# EasyEDA Pro project U2HTS_F070F6.eprj

# Schematic Schematic1
Board Name: Board1; Create Date: 2025-01-21; Page Name: P1; Project Name: U2HTS-STM32F070C6; Schematic Name: Schematic1; Update Date: 2025-03-15; Company: 嘉立创EDA; Page Size: A4; Version: V1.0
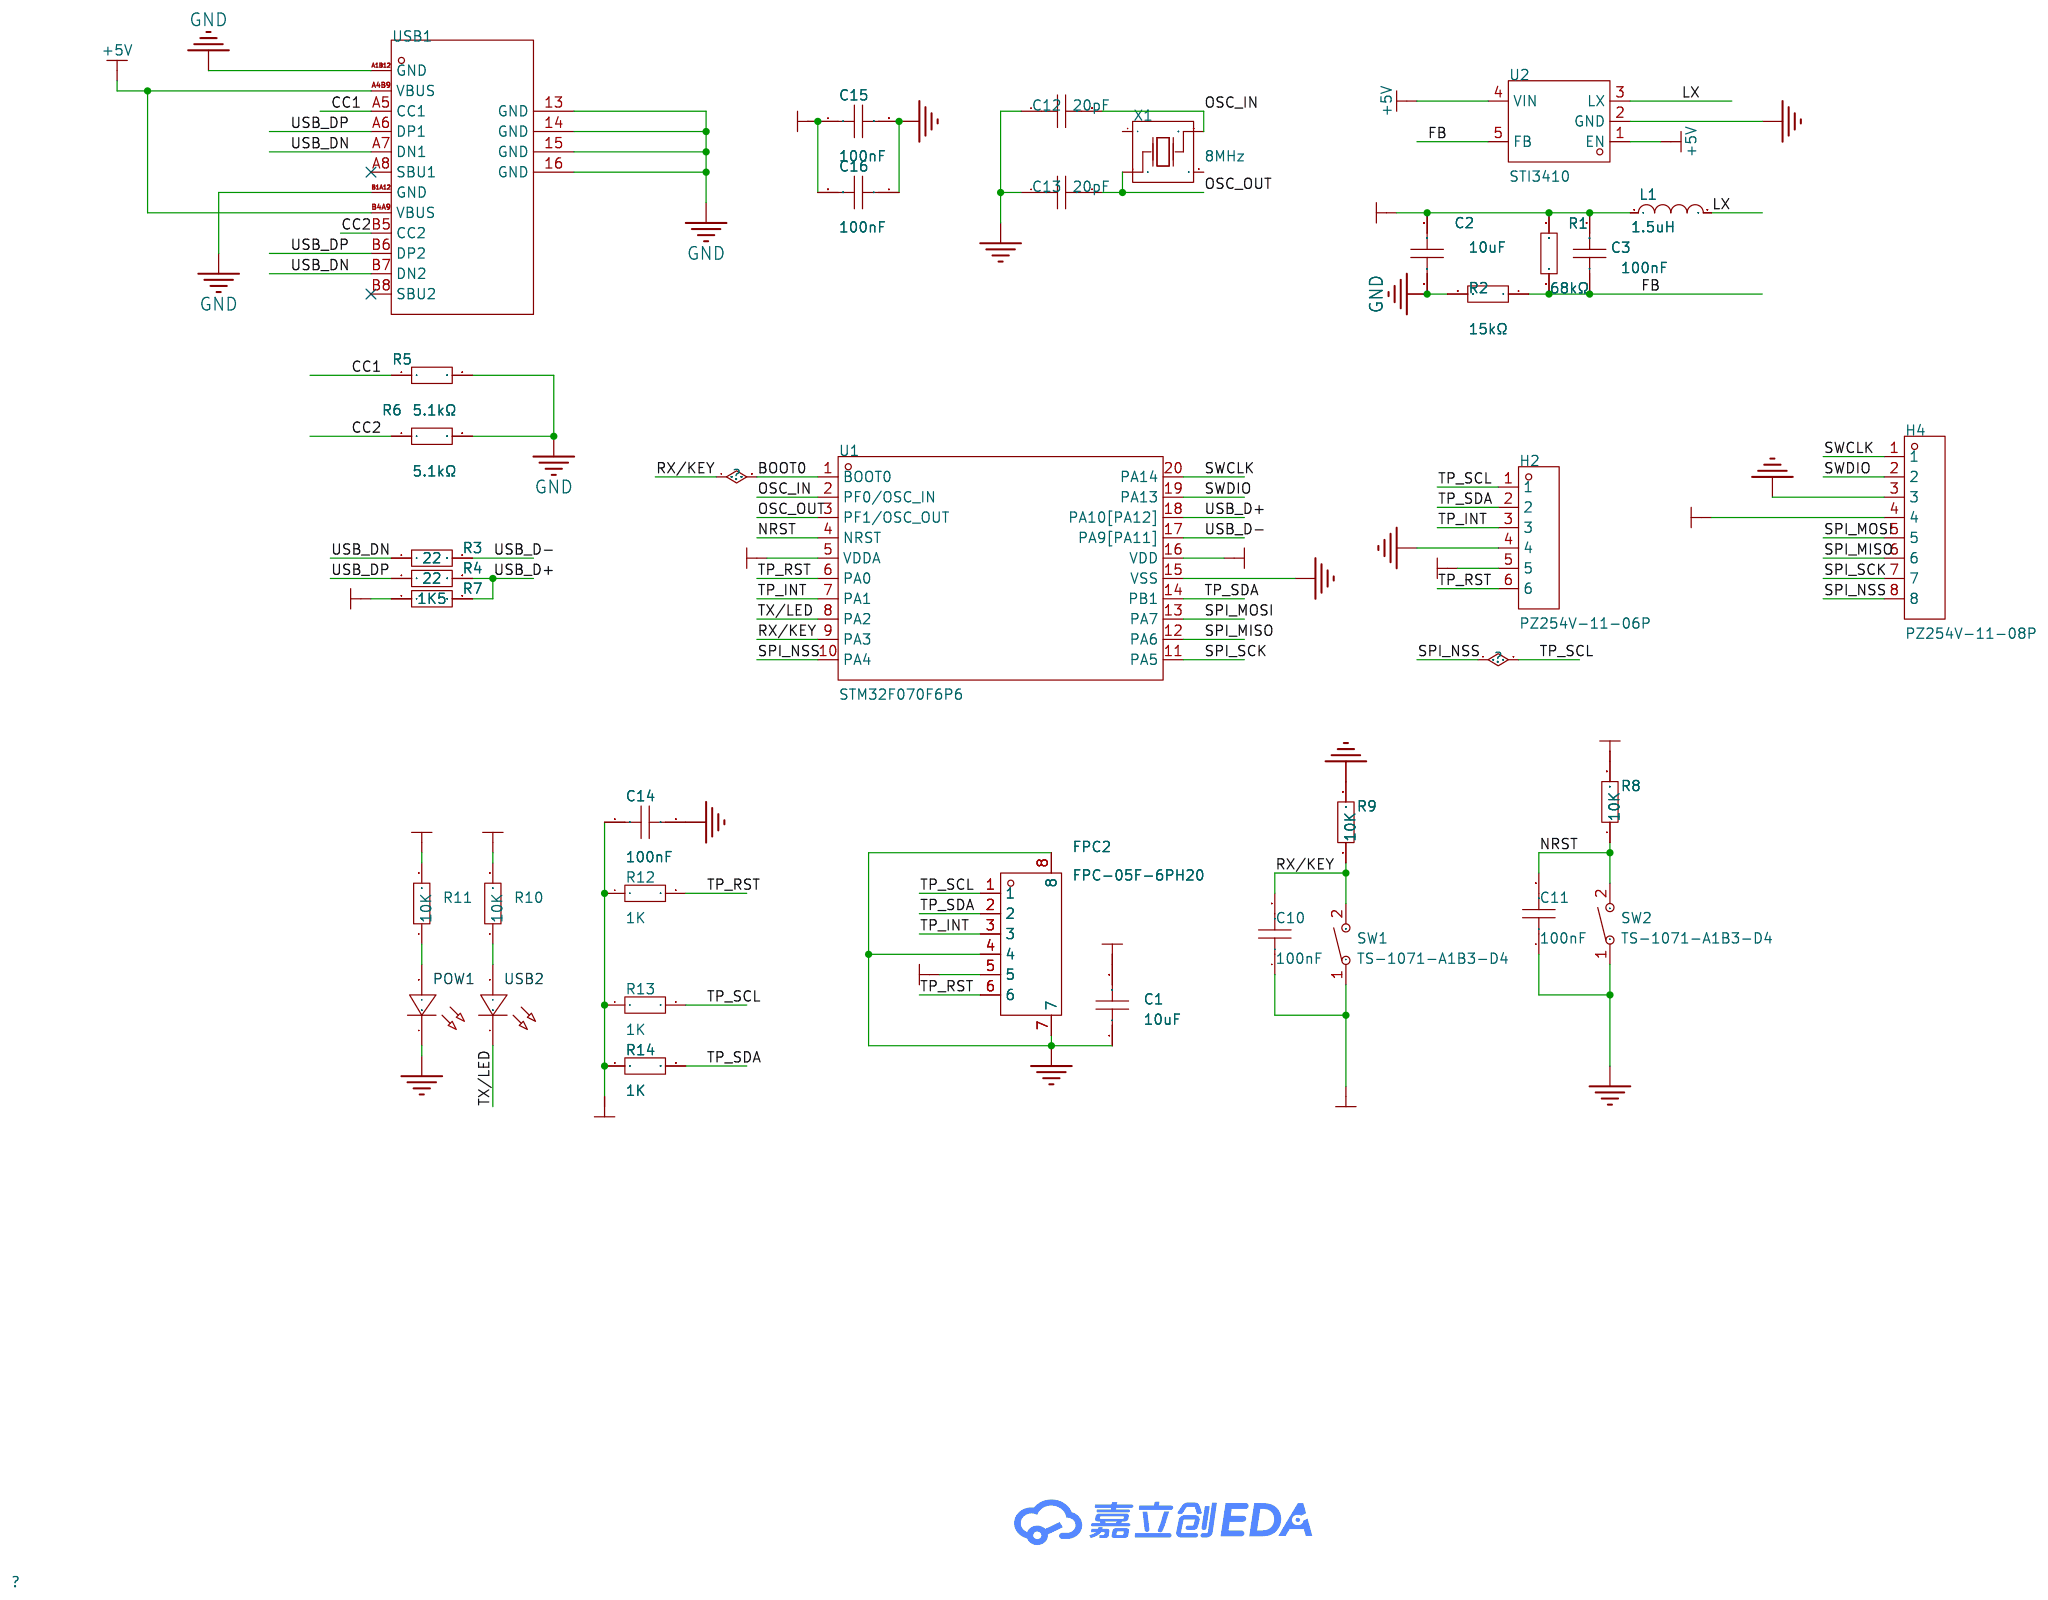
[diagram p0: schematic sheet]

## Parts
C1  10uF  [C0603]
C2  10uF  [C0603]
C3  100nF  [C0402]
C10  100nF  [C0402]
C11  100nF  [C0402]
C12  20pF  [C0402]
C13  20pF  [C0402]
C14  100nF  [C0402]
C15  100nF  [C0402]
C16  100nF  [C0402]
FPC2  FPC-05F-6PH20  [FPC-SMD_6P-P0.50_XUNPU_FPC-05F-6PH20]
H2  PZ254V-11-06P  [HDR-TH_6P-P2.54-V-M]
H4  PZ254V-11-08P  [HDR-TH_8P-P2.54-V-M]
L1  1.5uH  [L1008]
POW1  -  [LED_0603]
R1  68kΩ  [R0402]
R2  15kΩ  [R0402]
R3  22  [R0402]
R4  22  [R0402]
R5  5.1kΩ  [R0402]
R6  5.1kΩ  [R0402]
R7  1K5  [R0402]
R8  10K  [R0402]
R9  10K  [R0402]
R10  10K  [R0402]
R11  10K  [R0402]
R12  1K  [R0402]
R13  1K  [R0402]
R14  1K  [R0402]
SW1  TS-1071-A1B3-D4  [KEY-SMD_L4.0-W2.9-LS4.8]
SW2  TS-1071-A1B3-D4  [KEY-SMD_L4.0-W2.9-LS4.8]
U1  STM32F070F6P6  [TSSOP-20_L6.5-W4.4-P0.65-LS6.4-BL]
U2  STI3410  [SOT-23-5_L3.0-W1.7-P0.95-LS2.8-BL]
USB1  -  [USB-C-SMD_TYPEC-304-BCP16]
USB2  -  [LED_0603]
X1  8MHz  [CRYSTAL-SMD_4P-L3.2-W2.5-BL]

## Library data of the parts
C1 = CGA0603X5R106K100JT: 容值:10uF;精度:±10%;额定电压:10V;材质(温度系数):X5R;; LCSC Part Name: 10uF ±10% 10V; Supplier Part: C6119842; Manufacturer: HRE(芯声); Supplier Footprint: 0603; JLCPCB Part Class: Extended Part; Supplier: LCSC; Tolerance: ±10%; Voltage Rated: 10V; Temperature Coefficient: X5R
C2 = HGC0603R5106M160NTHJ: 容值:10uF;精度:±20%;额定电压:16V;材质(温度系数):X5R;; LCSC Part Name: 10uF ±20% 16V; Supplier Part: C7472959; Manufacturer: Chinocera(华瓷); Supplier Footprint: 0603; JLCPCB Part Class: Extended Part; Datasheet: https://atta.szlcsc.com/upload/public/pdf/source/20240320/FAC3FEC40A78BC5CCCE96C232A94D860.pdf; Supplier: LCSC; Tolerance: ±20%; Voltage Rated: 16V; Temperature Coefficient: X5R
C3 = GRM155R71H104KE14D: 容值:100nF;精度:±10%;额定电压:50V;材质(温度系数):X7R;; LCSC Part Name: 100nF ±10% 50V; Supplier Part: C77020; Manufacturer: muRata(村田); Supplier Footprint: 0402; JLCPCB Part Class: Extended Part; Datasheet: https://atta.szlcsc.com/upload/public/pdf/source/20180326/C77020_39BD49C951FF1AF0DB1F1FAC5AC1E401.pdf; Supplier: LCSC; Tolerance: ±10%; Voltage Rated: 50V; Temperature Coefficient: X7R
C10-C13 = CAP_0603: Supplier Footprint: 0603
C14-C16 = CAP_0402: Supplier Footprint: 0402
FPC2 = FPC-05F-6PH20: 锁定特性:翻盖式;触点类型:下接;触点数量:6P;间距:0.5mm;安装类型:卧贴;工作温度范围:-25℃~+85℃;; LCSC Part Name: 间距:0.5mm P数:6P 翻盖式 下接; Supplier Part: C2856796; Manufacturer: XUNPU(讯普); Supplier Footprint: SMD,P=0.5mm,卧贴; JLCPCB Part Class: 扩展库; Datasheet: https://atta.szlcsc.com/upload/public/pdf/source/20210922/16B003FB53336DDF6538142CC465AC4D.pdf; Supplier: LCSC; Locking Feature: 翻盖式; Contact Type: 下接; Number of Contacts: 6P; Pitch: 0.5mm; Mounting Type: 卧贴; FFC, FCB Thickness: 0.3mm; Height Above Board: 2mm; Operating Temperature Range: -25℃~+85℃
H2 = PZ254V-11-06P: LCSC Part Name: 间距:2.54mm 1x6P 直插 方针; Supplier Part: C492405; Manufacturer: XFCN(兴飞); Supplier Footprint: 插件,P=2.54mm; JLCPCB Part Class: 扩展库; Datasheet: https://atta.szlcsc.com/upload/public/pdf/source/20200309/C492405_597F1930F5B55CC3C7FD95458F1C3977.pdf; Supplier: LCSC; Pin Structure: 1x6P; Pitch: 2.54mm; Circluar Pins/Square Pins: 方针; Mounting Type: 直插; Number of Rows: 单排; Number of Pins: 6P; Length of Mating Pin: 6mm; Insulation Height: 2.5mm; Length of End Connection Pin: 3mm; Contact Material: 黄铜; Operating Temperature Range: -40℃~+105℃; Color: 黑色
H4 = PZ254V-11-08P: LCSC Part Name: 间距:2.54mm 1x8P 直插 方针; Supplier Part: C492407; Manufacturer: XFCN(兴飞); Supplier Footprint: 插件,P=2.54mm; JLCPCB Part Class: 扩展库; Datasheet: https://atta.szlcsc.com/upload/public/pdf/source/20200309/C492407_83A6FB26A2233368EDB9516968EC6149.pdf; Supplier: LCSC; Pin Structure: 1x8P; Pitch: 2.54mm; Circluar Pins/Square Pins: 方针; Mounting Type: 直插; Number of Rows: 单排; Number of Pins: 8P; Length of Mating Pin: 6mm; Insulation Height: 2.5mm; Length of End Connection Pin: 3mm; Contact Material: 黄铜; Operating Temperature Range: -40℃~+105℃; Color: 黑色
L1 = FHD252010S-1R5MT: 电感值:1.5uH;精度:±20%;额定电流:2.3A;饱和电流(Isat):3A;; LCSC Part Name: 1.5uH ±20% 3A; Supplier Part: C602003; Manufacturer: cjiang(长江微电); Supplier Footprint: 1008; JLCPCB Part Class: Extended Part; Datasheet: https://atta.szlcsc.com/upload/public/pdf/source/20200609/C601990_BCEA243EC4DA0A9A288AA78A6DFB48A5.pdf; Supplier: LCSC; Tolerance: ±20%; Rated Current: 2.3A; Saturation Current (Isat): 3A; DC Resistance (DCR): 90mΩ
POW1 = LED_0603-G: Supplier Footprint: 0603
R1 = 0402WGF6802TCE: 电阻类型:厚膜电阻;阻值:68kΩ;精度:±1%;功率:62.5mW;最大工作电压:50V;温度系数:±100ppm/℃;; LCSC Part Name: 68kΩ ±1% 62.5mW 厚膜电阻; Supplier Part: C36871; Manufacturer: UNI-ROYAL(厚声); Supplier Footprint: 0402; JLCPCB Part Class: Extended Part; Datasheet: https://atta.szlcsc.com/upload/public/pdf/source/20200306/C422600_1E6D84923E4A46A82E41ADD87F860B5C.pdf; Supplier: LCSC; Type: 厚膜电阻; Tolerance: ±1%; Power(Watts): 62.5mW; Overload Voltage (Max): 50V; Temperature Coefficient: ±100ppm/℃; Operating Temperature Range: -55℃~+155℃
R2 = 0402WGF1502TCE: 电阻类型:厚膜电阻;阻值:15kΩ;精度:±1%;功率:62.5mW;最大工作电压:50V;温度系数:±100ppm/℃;; LCSC Part Name: 15kΩ ±1% 62.5mW 厚膜电阻; Supplier Part: C25756; Manufacturer: UNI-ROYAL(厚声); Supplier Footprint: 0402; JLCPCB Part Class: Basic Part; Datasheet: https://atta.szlcsc.com/upload/public/pdf/source/20200306/C422600_1E6D84923E4A46A82E41ADD87F860B5C.pdf; Supplier: LCSC; Type: 厚膜电阻; Tolerance: ±1%; Power(Watts): 62.5mW; Overload Voltage (Max): 50V; Temperature Coefficient: ±100ppm/℃; Operating Temperature Range: -55℃~+155℃
R3 R4 R7-R11 = Res_0603: Supplier Footprint: 0603
R5 R6 = RMC04025.1K1%N: 阻值:5.1kΩ;精度:±1%;功率:62.5mW;; LCSC Part Name: 5.1kΩ ±1% 62.5mW; Supplier Part: C325521; Manufacturer: Tyohm(幸亚电阻); Supplier Footprint: 0402; JLCPCB Part Class: Extended Part; Datasheet: https://atta.szlcsc.com/upload/public/pdf/source/20190115/C325521_1EC5F156994D781C7E2B08432302F19F.pdf; Supplier: LCSC; Tolerance: ±1%; Power(Watts): 62.5mW
R12-R14 = Res_0402: Supplier Footprint: 0402
SW1 SW2 = TS-1071-A1B3-D4: 电路结构:单刀单掷;安装方式:-;按钮形状:圆形按钮;带灯:-;作用力:250gf@±30gf;开关长度:4mm;开关宽度:3mm;开关高度:2mm;; LCSC Part Name: 轻触开关4.0*3.0*2两脚贴片带柱小龟250gf; Supplier Part: C492877; Manufacturer: Yuandi(元迪); JLCPCB Part Class: 扩展库; Datasheet: https://atta.szlcsc.com/upload/public/pdf/source/20200316/C492878_F665FC46291D1CEBBF5F4DDB4422506A.pdf; Supplier: LCSC; Circuit: 单刀单掷; Actuator Style: 圆形按钮; Operating Force: 250gf@±30gf; Switch Length: 4mm; Switch Width: 3mm; Switch Height: 2mm
U1 = STM32F070F6P6: LCSC Part Name: 主流ARM Cortex-M0超值系列MCU，具有至多32 KB Flash、48 MHz CPU和USB功能; Supplier Part: C86951; Manufacturer: ST(意法半导体); Supplier Footprint: TSSOP-20; JLCPCB Part Class: 扩展库; Datasheet: https://atta.szlcsc.com/upload/public/pdf/source/20170105/1483608757662.pdf; Supplier: LCSC; CPU Core: ARM-M0; CPU Maximum Speed: 48MHz; Program Storage Size: 32KB; Program Memory Type: FLASH; Number of I/O: 15; ADC (Bit): 12bit; Low Voltage Detection Threshold: 2.4V~3.6V
U2 = STI3410: 功能类型:降压型;输出类型:可调;工作电压:2.3V~6V;输出电压:600mV~6V;输出电流:1.5A;; LCSC Part Name: 1.0MHz 1.5A 同步降压转换器; Supplier Part: C711928; Manufacturer: TMI(拓尔微); Supplier Footprint: SOT-23-5; JLCPCB Part Class: 扩展库; Datasheet: https://atta.szlcsc.com/upload/public/pdf/source/20240703/A4E038F154E42B2F4CBA4BC59A7F6257.pdf; Supplier: LCSC; Function: 降压型; Output Type: 可调; Input Voltage: 2.3V~6V; Output Voltage: 600mV~6V; Output Current: 1.5A; Switching Frequency: 1MHz; Operating Temperature: -40℃~+85℃; Synchronous Rectification: 是; Number of Outputs: 1; Topology: 降压式; Quiescent Current (Iq): 40uA; Switch tube (built-in/external): 内置
USB1 = typec-304-bcp16: 连接器类型:Type-C;标准:USB 3.1;公母:母座;触点数量:16.0;端口数量:1;安装方式:卧贴;额定电流 - 电源:3A;工作温度范围:-25~+85;焊接温度(最大值):260;; LCSC Part Name: TYPEC-304-BCP16; Supplier Part: C720629; Manufacturer: XUNPU(讯普); Manufacturer Part: TYPEC-304-BCP16; Supplier Footprint: SMD; JLCPCB Part Class: Extended Part; Datasheet: https://atta.szlcsc.com/upload/public/pdf/source/20211022/DACD6552F639E9483017DE6DC0E61150.pdf; Supplier: LCSC; Connector Type: Type-C; Standard: USB 3.1; Gender: 母座; Number of Contacts: 16; Number of Ports: 1; Mounting Sytle: 卧贴; Current Rating - Power (Max): 3A; Operating Temperature Range: -25~+85; Welding Temperature (Max): 260
USB2 = LED_0603-B: Supplier Footprint: 0603
X1 = TAXM8M4RDBCCT2T: 晶振类型:贴片晶振;频率:8MHz;常温频差:±10ppm;负载电容:10pF;频率稳定度(全温):±15ppm;; LCSC Part Name: 8MHz ±10ppm 10pF; Supplier Part: C400090; Manufacturer: YJX(雅晶鑫); Supplier Footprint: SMD3225-4P; JLCPCB Part Class: 扩展库; Datasheet: https://atta.szlcsc.com/upload/public/pdf/source/20190626/C400090_CF95B89E745AFE4EF2E392EF8AC009D6.pdf; Supplier: LCSC; Crystal Type: 贴片晶振; Normal temperature Frequency Tolerance: ±10ppm; Load Capacitor: 10pF; Frequency Stability(Full temperature range): ±15ppm; Equivalent Series Resistance (ESR): 250Ω; Operating Temperature: -40℃~+85℃

## Nets
3V3: C1.2 C2.2 C3.2 C10.1 C14.1 C15.1 C16.2 FPC2.5 H2.5 H4.4 L1.1 R1.2 R7.1 R8.2 R10.2 R11.2 R12.1 R13.1 R14.1 SW1.1 U1.5(VDDA) U1.16(VDD)
+5V: U2.1(EN) U2.4(VIN) USB1.A4B9(VBUS) USB1.B4A9(VBUS)
GND: C1.1 C2.1 C11.1 C12.1 C13.1 C14.2 C15.2 C16.1 FPC2.4 FPC2.7 FPC2.8 H2.4 H4.3 POW1.1(C) R2.2 R5.2 R6.2 R9.2 SW2.1 U1.15(VSS) U2.2(GND) USB1.13(GND) USB1.14(GND) USB1.15(GND) USB1.16(GND) USB1.A1B12(GND) USB1.B1A12(GND)
BOOT0: C10.2 R9.1 SW1.2 U1.1(BOOT0) U1.9(PA3)
CC1: R5.1 USB1.A5(CC1)
CC2: R6.1 USB1.B5(CC2)
FB: C3.1 R1.1 R2.1 U2.5(FB)
LX: L1.2 U2.3(LX)
NRST: C11.2 R8.1 SW2.2 U1.4(NRST)
OSC_IN: C12.2 U1.2(PF0/OSC_IN) X1.3
OSC_OUT: C13.2 U1.3(PF1/OSC_OUT) X1.1
SPI_MISO: H4.6 U1.12(PA6)
SPI_MOSI: H4.5 U1.13(PA7)
SPI_NSS: FPC2.1 H2.1 H4.8 R13.2 U1.10(PA4)
SPI_SCK: H4.7 U1.11(PA5)
SWCLK: H4.1 U1.20(PA14)
SWDIO: H4.2 U1.19(PA13)
TP_INT: FPC2.3 H2.3 U1.7(PA1)
TP_RST: FPC2.6 H2.6 R12.2 U1.6(PA0)
TP_SDA: FPC2.2 H2.2 R14.2 U1.14(PB1)
TX/LED: U1.8(PA2) USB2.1(C)
USB_D+: R4.2 R7.2 U1.18(PA10[PA12])
USB_D-: R3.2 U1.17(PA9[PA11])
USB_DN: R3.1 USB1.A7(DN1) USB1.B7(DN2)
USB_DP: R4.1 USB1.A6(DP1) USB1.B6(DP2)
$1N1839: POW1.2(A) R11.1
$1N1840: R10.1 USB2.2(A)

Not connected (* = marked no-connect by the designer): USB1 A8(SBU1)* B8(SBU2)*; X1 2 4

# Board PCB1
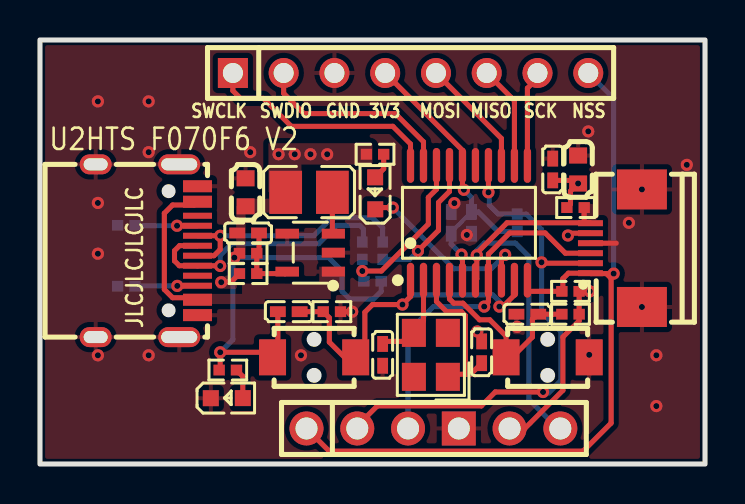
[diagram p1: board, top side]
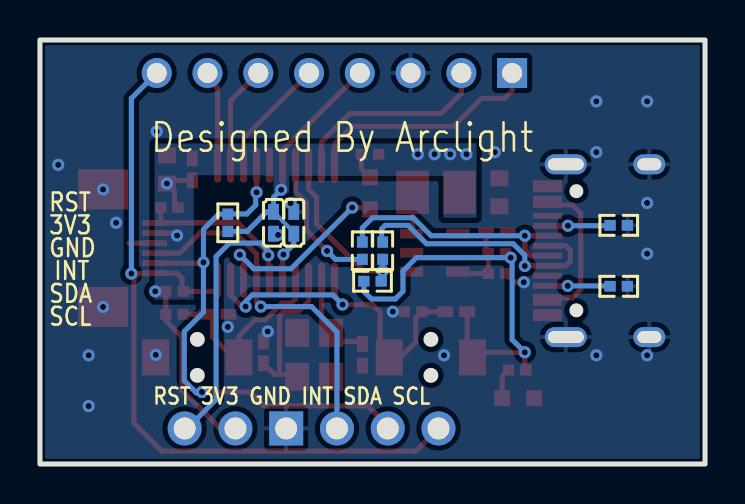
[diagram p2: board, bottom side, seen from below]

Outline 33.27 x 21.21 mm; copper layers: Top Layer, Inner1, Inner2, Inner3, Inner4, Inner5, Inner6, Inner7, Inner8, Inner9, Inner10, Inner11, Inner12, Inner13, Inner14, Inner15, Inner16, Inner17, Inner18, Inner19, Inner20, Inner21, Inner22, Inner23, Inner24, Inner25, Inner26, Inner27, Inner28, Inner29, Inner30, Bottom Layer. Coordinates in mm from the lower left corner of the outline.
Outline path: rectangle 0,21.21 33.27,0
Stack: Top Layer 0.035mm / Dielectric1 1.51mm FR4 er 4.5 / Bottom Layer 0.035mm

## Design rules (mm)
template: JLCPCB Capability(Two Layers Board)
spacing copperThickness1oz (default): track to track 0.102, other pairs 0.152 to 0.3
spacing copperThickness2oz: track to track 0.203, other pairs 0.152 to 0.3
track width copperThickness1oz (default): min 0.127, default 0.254, max 2.54
track width copperThickness2oz: min 0.203, default 0.254, max 2.54
differential pair differentialPair (default): width min 0.127, default 0.254, max 2.54; gap min 0.152, default 0.152
via viaSize (default): diameter min 0.5, default 0.61, max 10; hole min 0.3, default 0.305, max 6.3

## Placement (name value [footprint] x y rotation side)
C1  10uF  [C0603]  26.92 14.73 270 top
C2  10uF  [C0603]  10.29 13.59 270 top
C3  100nF  [C0402]  10.41 11.56 180 top
C10  100nF  [C0402]  12.45 7.62 0 top
C11  100nF  [C0402]  24.38 7.49 0 top
C12  20pF  [C0402]  17.15 5.46 90 top
C13  20pF  [C0402]  22.1 5.59 270 top
C14  100nF  [C0402]  25.65 14.73 90 top
C15  100nF  [C0402]  20.57 12.06 90 bottom
C16  100nF  [C0402]  21.59 12.06 90 bottom
FPC2  FPC-05F-6PH20  [FPC-SMD_6P-P0.50_XUNPU_FPC-05F-6PH20]  28.83 10.8 90 top
H2  PZ254V-11-06P  [HDR-TH_6P-P2.54-V-M]  19.69 1.78 0 top
H4  PZ254V-11-08P  [HDR-TH_8P-P2.54-V-M]  18.54 19.56 0 top
L1  1.5uH  [L1008]  13.46 13.59 0 top
POW1  -  [LED_0603]  9.4 3.3 0 top
R1  68kΩ  [R0402]  10.41 10.54 180 top
R2  15kΩ  [R0402]  10.41 9.53 180 top
R3  22  [R0402]  17.15 10.67 270 bottom
R4  22  [R0402]  16.13 10.67 270 bottom
R5  5.1kΩ  [R0402]  4.32 11.94 180 bottom
R6  5.1kΩ  [R0402]  4.32 8.89 180 bottom
R7  1K5  [R0402]  16.64 9.14 180 bottom
R8  10K  [R0402]  26.54 7.49 0 top
R9  10K  [R0402]  14.6 7.62 0 top
R10  10K  [R0402]  16.76 15.49 180 top
R11  10K  [R0402]  9.4 4.7 180 top
R12  1K  [R0402]  26.8 12.83 0 top
R13  1K  [R0402]  26.54 8.64 180 top
R14  1K  [R0402]  23.88 12.06 90 bottom
SW1  TS-1071-A1B3-D4  [KEY-SMD_L4.0-W2.9-LS4.8]  13.72 5.33 0 top
SW2  TS-1071-A1B3-D4  [KEY-SMD_L4.0-W2.9-LS4.8]  25.4 5.33 180 top
U1  STM32F070F6P6  [TSSOP-20_L6.5-W4.4-P0.65-LS6.4-BL]  21.46 12.06 0 top
U2  STI3410  [SOT-23-5_L3.0-W1.7-P0.95-LS2.8-BL]  13.53 10.57 90 top
USB1  -  [USB-C-SMD_TYPEC-304-BCP16]  5.33 10.67 270 top
USB2  -  [LED_0603]  16.76 13.59 90 top
X1  8MHz  [CRYSTAL-SMD_4P-L3.2-W2.5-BL]  19.56 5.46 90 top

## Footprints (pads in the part's own frame, mm; a bottom-side part is the same pattern mirrored in y, then rotated)
C0402
  rect 0.79x0.54 smd: 1(-0.545,0) 2(0.545,0)
C0603
  rect 0.8x0.9 smd: 1(-0.7,0) 2(0.7,0)
CRYSTAL-SMD_4P-L3.2-W2.5-BL
  rect 1.4x1.2 smd: 1(-1.1,-0.85) 2(1.1,-0.85) 3(1.1,0.85) 4(-1.1,0.85)
FPC-SMD_6P-P0.50_XUNPU_FPC-05F-6PH20
  rect 0.3x1.25 smd: 1(-1.25,1.288) 2(-0.75,1.288) 3(-0.25,1.288) 4(0.25,1.288) 5(0.75,1.288) 6(1.25,1.288)
  rect 2x2.5 smd: 7(2.94,-1.288) 8(-2.94,-1.288)
HDR-TH_6P-P2.54-V-M
  round 1.7 hole 1.1: 1(-6.35,0) 2(-3.81,0) 3(-1.27,0) 5(3.81,0) 6(6.35,0)
  rect 1.7x1.7 hole 1.1: 4(1.27,0)
HDR-TH_8P-P2.54-V-M
  rect 1.5x1.5 hole 1: 1(-8.89,0)
  round 1.5 hole 1: 2(-6.35,0) 3(-3.81,0) 4(-1.27,0) 5(1.27,0) 6(3.81,0) 7(6.35,0) 8(8.89,0)
KEY-SMD_L4.0-W2.9-LS4.8
  rect 1.35x1.8 smd: 1(-2.08,0) 2(2.08,0)
L1008
  rect 1.635x2.16 smd: 1(-1.167,0) 2(1.167,0)
LED_0603
  rect 0.8x0.8 smd: 1(-0.851,-0.01) 2(0.75,-0.005)
R0402
  rect 0.566x0.54 smd: 1(-0.433,0) 2(0.433,0)
SOT-23-5_L3.0-W1.7-P0.95-LS2.8-BL
  rect 0.49x1.157 smd: 1(-0.95,-1.153) 2(0,-1.153) 3(0.95,-1.153)
  rect 0.49x1.175 smd: 4(0.95,1.153) 5(-0.95,1.153)
TSSOP-20_L6.5-W4.4-P0.65-LS6.4-BL
  oval 0.364x1.742 smd: 1(-2.925,-2.871) 2(-2.275,-2.871) 3(-1.625,-2.871) 4(-0.975,-2.871) 5(-0.325,-2.871) 6(0.325,-2.871) 7(0.975,-2.871) 8(1.625,-2.871) 9(2.275,-2.871) 10(2.925,-2.871) 11(2.925,2.871) 12(2.275,2.871) 13(1.625,2.871) 14(0.975,2.871) 15(0.325,2.871) 16(-0.325,2.871) 17(-0.975,2.871) 18(-1.625,2.871) 19(-2.275,2.871) 20(-2.925,2.871)
USB-C-SMD_TYPEC-304-BCP16
  oval 1.001x2.1 hole 0.6x1.801: 13(-4.321,1.633) 14(4.321,1.633)
  oval 1.001x1.6 hole 0.6x1.199: 15(-4.321,-2.547) 16(4.321,-2.547)
  rect 0.6x1.45 smd: A1B12(-3.226,2.547) A4B9(-2.451,2.547) B1A12(3.22,2.547) B4A9(2.451,2.547)
  rect 0.299x1.45 smd: A5(-1.25,2.547) A6(-0.249,2.547) A7(0.249,2.547) A8(1.25,2.547) B5(1.75,2.547) B6(0.75,2.547) B7(-0.75,2.547) B8(-1.75,2.547)

## Nets
As in the schematic.

Pads without a net: USB1 A8 B8; X1 2 4

## Via types
v1: diameter 0.61, hole 0.305, Top Layer to Bottom Layer, 50 vias

## Routing (per net, layer and track width the routed paths; a pad name or vN(x,y) marks a point on that pad's centre or on a via; arc(x,y) is an arc through that point)
3V3: length 49.4
  Top Layer w0.254: v1(21.21,13.72) 21.14,13.79 U1.16 21.14,15.69 17.4,19.43 ; H2.5 24.26,1.78 26.16,3.68 26.16,6.35 26.98,7.16 R13.1 v1(27.51,8.64) ; v1(26.42,11.43) 26.53,11.55 FPC2.5 ; R1.2 9.76,10.32 v1(9.73,10.32) ; C10.1 11.9,5.6 SW1.1 11.38,5.59 v1(9.02,5.59) 9.02,4.75 R11.2 ; U1.5 21.14,10.43 v1(21.09,10.48) ; C14.1 26.77,14.19 v1(26.92,14.03) 26.54,13.65 26.54,13.01 R12.1
  Bottom Layer w0.203: C15.1 20.57,11.59 20.94,11.96 20.95,11.96 21.1,12.11 21.1,12.12 C16.2
  Bottom Layer w0.254: v1(9.02,5.59) 9.65,6.22 9.65,10.25 v1(9.73,10.32) 14.44,10.32 15.11,9.65 15.11,8.64 15.49,8.25 16.69,8.25 17.07,8.64 R7.1 ; v1(21.09,10.48) 20.57,11 C15.1 ; R14.1 22.91,11.63 21.93,12.61 C16.2 21.59,13.33 v1(21.21,13.72)
  vias: v1(11.94,15.49) v1(12.75,15.49) v1(13.53,15.49) v1(14.37,15.49)
+5V: length 7.6
  Top Layer w0.254: USB1.A4B9 7.72,12.95 6.63,12.95 6.22,12.54 6.22,8.73 6.63,8.32 7.78,8.32 7.88,8.22
GND: length 3
  Top Layer w0.254: v1(9.07,9.09) 9.55,9.09 R2.2 ; v1(15.62,7.62) R9.2 ; FPC2.4 28.83,11.05
  vias: v1(2.9,18.14) v1(2.9,13.06) v1(2.9,10.52) v1(2.9,5.44) v1(5.44,18.14) v1(5.44,15.6) v1(5.44,5.44) v1(10.52,15.6) v1(13.06,5.44) v1(20.73,13.05) v1(21.36,11.46) v1(21.88,6.63) v1(23.88,6.86) v1(27.43,16.64) v1(27.48,5.46) v1(29.46,12.06) v1(30.12,13.73) v1(30.12,7.86) v1(30.84,5.44) v1(30.84,2.9) v1(32.36,14.96)
BOOT0: length 17.5
  Top Layer w0.254: U1.9 23.75,9.18 23.75,8.46 23.23,7.95 23.06,7.95 v1(22.99,7.87) ; U1.1 18.54,8.38 v1(18.14,7.98) 16.64,7.98 16.26,7.59 16.26,5.79 SW1.2 15.24,5.33 14.48,6.1 14.48,7.23 14.48,7.23 14.48,7.32 R9.1 C10.2
  Bottom Layer w0.254: v1(22.99,7.87) 22.99,8.13 22.66,8.46 18.62,8.46 v1(18.14,7.98)
CC1: length 3.1
  Top Layer w0.254: USB1.A5 v1(6.86,11.92)
  Bottom Layer w0.254: v1(6.86,11.92) 4.77,11.92 R5.1
CC2: length 3.1
  Top Layer w0.254: USB1.B5 7.11,8.92 7.1,8.91 v1(6.87,8.91)
  Bottom Layer w0.254: v1(6.87,8.91) 4.77,8.91 R6.1
FB: length 3.6
  Top Layer w0.254: U2.5 12.28,9.53 R2.1 R1.1 10.96,10.65 C3.1
LX: length 2.1
  Top Layer w0.254: 14.68,11.52 14.63,11.57 L1.2
NRST: length 9.7
  Top Layer w0.254: U1.4 20.49,8.26 20.7,8.04 21.16,8.04 21.99,7.21 22.5,7.21 23.32,6.4 23.32,5.46 23.75,5.46 24.64,6.35 24.64,7.24 24.89,7.49 25.98,7.49 26.11,7.62
OSC_IN: length 4.5
  Top Layer w0.254: 17.15,6.13 18.15,6.13 19.19,7.17 U1.2
OSC_OUT: length 7.7
  Top Layer w0.254: 22.1,5.04 21.54,4.49 21.29,4.49 ; 21.29,4.49 20.41,4.49 ; 21.29,4.49 21.29,4.49 21.29,7.42 21.08,7.62 20.35,7.62 19.84,8.13 U1.3
SPI_MISO: length 5
  Top Layer w0.254: 22.48,19.43 23.74,18.17 U1.12
SPI_MOSI: length 5.8
  Top Layer w0.254: U1.13 23.09,16.28 19.94,19.43
SPI_NSS: length 39.8
  Top Layer w0.254: U1.10 24.39,8.64 R13.2 26.16,8.69 26.16,9.27 26.44,9.55 FPC2.1 27.56,9.53 28.34,9.53 ; 28.34,9.53 v1(28.7,9.53) ; 28.34,9.53 28.57,9.29 28.57,2.05 27.18,0.65 14.46,0.65 H2.1
  Bottom Layer w0.254: 27.56,19.43 28.7,18.29 v1(28.7,9.53)
SPI_SCK: length 4.8
  Top Layer w0.254: U1.11 24.39,18.8 25.02,19.43
SWCLK: length 11.9
  Top Layer w0.254: H4.1 9.65,18.67 10.03,18.29 11.18,18.29 12.57,16.89 17.65,16.89 18.54,16.01 U1.20
SWDIO: length 10.2
  Top Layer w0.254: H4.2 12.19,18.54 13.21,17.53 17.78,17.53 19.19,16.12 U1.19
TP_INT: length 17.8
  Top Layer w0.254: v1(22.22,7.87) 22.4,8.05 22.4,8.11 22.44,8.14 U1.7 22.44,10.5 23.5,11.56 25.27,11.56 26.28,10.55 FPC2.3
  Bottom Layer w0.254: v1(22.22,7.87) 19.69,7.87 18.41,6.6 H2.3
TP_RST: length 21.1
  Top Layer w0.254: 27.23,12.06 27.52,12.06 FPC2.6 ; 27.23,12.06 R12.2 ; 27.23,12.06 23.37,12.06 21.85,10.55 v1(21.85,10.44) 21.85,9.26 U1.6
  Bottom Layer w0.254: v1(21.85,10.44) 21.85,10.68 22.22,11.05 23.79,11.05 24.46,10.38 24.46,3.23 25.91,1.78 H2.6
TP_SDA: length 26.8
  Top Layer w0.254: v1(25.17,3.6) 22.78,3.6 22.08,2.91 16.88,2.91 15.88,1.91 H2.2 ; FPC2.2 25.14,10.05 v1(25.09,10.09) ; U1.14 v1(22.44,13.59)
  Bottom Layer w0.254: v1(22.44,13.59) 22.48,13.55 22.48,12.95 22.92,12.51 23.86,12.51 R14.2 24.33,12.5 25.09,11.73 v1(25.09,10.09) 25.09,7.59 26.05,6.63 26.05,4.16 25.45,3.56 25.22,3.56 v1(25.17,3.6)
TX/LED: length 9.4
  Top Layer w0.254: U1.8 23.09,10.28 v1(23.27,10.47) ; v1(17.65,12.83) 16.86,12.83 USB2.1
  Bottom Layer w0.254: v1(23.27,10.47) 22.57,9.77 20.71,9.77 v1(17.65,12.83)
USB_D+: length 8.5
  Top Layer w0.254: v1(16.13,9.65) 17.08,9.65 19.43,12 19.43,13.33 19.84,13.74 U1.18
  Bottom Layer w0.254: R4.2 v1(16.13,9.65) 16.13,9.22 R7.2
USB_D-: length 6.9
  Top Layer w0.254: U1.17 20.49,13.63 19.94,13.08 19.94,11.69 v1(18.91,10.66)
  Bottom Layer w0.254: R3.2 18.49,10.23 v1(18.91,10.66)
USB_DN: length 12.5
  Top Layer w0.254: USB1.A7 8.7,10.42 9.02,10.73 v1(9.02,11.42) USB1.B7
  Bottom Layer w0.254: v1(9.02,11.42) 13.7,11.42 14.6,12.32 16.64,12.32 17.15,11.81 17.15,11.1
USB_DP: length 13.2
  Top Layer w0.254: v1(9.02,9.91) 9,9.92 USB1.B6 6.97,9.92 6.73,10.16 6.73,10.67 6.98,10.92 7.88,10.92 USB1.A6
  Bottom Layer w0.254: v1(9.02,9.91) 9.02,10.44 9.59,11.02 13.94,11.02 14.86,11.94 16,11.94 16.18,11.76 16.18,11.15 16.13,11.1
$1N1839: length 1.5
  Top Layer w0.254: R11.1 10.15,4.38 10.15,3.3
$1N1840: length 1.3
  Top Layer w0.254: USB2.2 17.2,14.77 R10.1

## Copper pours and planes (outline as drawn; the poured copper is in the pictures)
3V3 on Top Layer: 9.82,12.89 10.29,12.89 10.29,10.28 9.82,10.28
3V3 on Top Layer: 11.43,16.05 16.64,16.05 16.64,13.6 11.43,13.6
3V3 on Bottom Layer: 11.43,16.05 27.54,16.05 27.54,8.23 11.43,8.23
+5V on Top Layer: 11.81,11.81 15.24,11.81 15.24,9.4 11.81,9.4
+5V on Top Layer: 7.52,9.87 15.27,9.87 15.27,8 7.52,8
GND on Top Layer: -2.67,22.61 35.56,22.61 35.56,-2.67 -2.67,-2.67
GND on Bottom Layer: -6.22,26.67 37.59,26.67 37.59,-4.44 -6.22,-4.44

Small or netless copper shapes (teardrops, artwork), in the pictures only: 1 on Top Layer, 1 on Bottom Layer

## Text on the board
Bottom Silkscreen Layer: RST 3V3 GND INT SDA SCL | INT | RST | 3V3 | GND | SDA | SCL | Designed By Arclight
Top Silkscreen Layer: SWCLK | SWDIO | GND | 3V3 | MOSI | MISO | SCK | NSS | JLCJLCJLCJLC | U2HTS F070F6 V2
